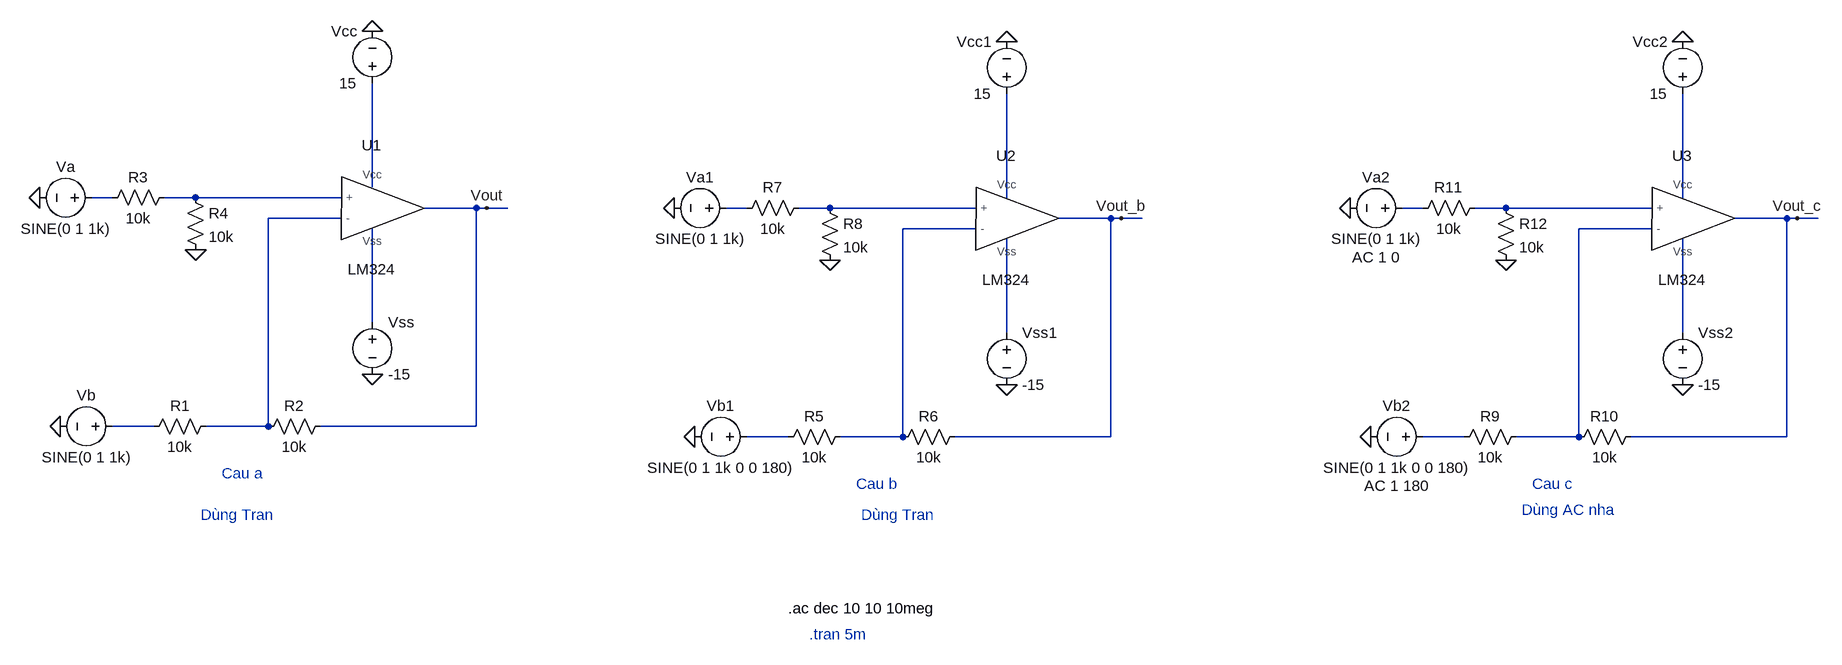
[diagram p0: schematic BAI 3 THUC HANH 3.asc]
BAI 3 THUC HANH 3.asc, the LTspice schematic file:
Version 4.1
SHEET 1 2488 800
WIRE 128 96 128 -64
WIRE -272 112 -304 112
WIRE -144 112 -192 112
WIRE 80 112 -144 112
WIRE 1104 112 1104 -48
WIRE 2144 112 2144 -48
WIRE 288 128 208 128
WIRE 304 128 288 128
WIRE 336 128 304 128
WIRE 704 128 672 128
WIRE 832 128 784 128
WIRE 1056 128 832 128
WIRE 1744 128 1712 128
WIRE 1872 128 1824 128
WIRE 2096 128 1872 128
WIRE 80 144 -32 144
WIRE 1264 144 1184 144
WIRE 1280 144 1264 144
WIRE 1312 144 1280 144
WIRE 2304 144 2224 144
WIRE 2320 144 2304 144
WIRE 2352 144 2320 144
WIRE 1056 160 944 160
WIRE 2096 160 1984 160
WIRE 128 304 128 160
WIRE 1104 320 1104 176
WIRE 2144 320 2144 176
WIRE -208 464 -272 464
WIRE -32 464 -32 144
WIRE -32 464 -128 464
WIRE 288 464 288 128
WIRE 288 464 48 464
WIRE 768 480 704 480
WIRE 944 480 944 160
WIRE 944 480 848 480
WIRE 1264 480 1264 144
WIRE 1264 480 1024 480
WIRE 1808 480 1744 480
WIRE 1984 480 1984 160
WIRE 1984 480 1888 480
WIRE 2304 480 2304 144
WIRE 2304 480 2064 480
FLAG 128 -144 0
FLAG 128 384 0
FLAG 304 128 Vout
FLAG -352 464 0
FLAG -144 192 0
FLAG -384 112 0
FLAG 1104 -128 0
FLAG 1104 400 0
FLAG 1280 144 Vout_b
FLAG 624 480 0
FLAG 832 208 0
FLAG 592 128 0
FLAG 2144 -128 0
FLAG 2144 400 0
FLAG 2320 144 Vout_c
FLAG 1664 480 0
FLAG 1872 208 0
FLAG 1632 128 0
SYMBOL LM324 128 128 R0
SYMATTR InstName U1
SYMBOL voltage 128 -48 R180
WINDOW 0 24 96 Left 2
WINDOW 3 24 16 Left 2
SYMATTR InstName Vcc
SYMATTR Value 15
SYMBOL voltage 128 288 R0
SYMATTR InstName Vss
SYMATTR Value -15
SYMBOL res -112 448 R90
WINDOW 0 0 56 VBottom 2
WINDOW 3 32 56 VTop 2
SYMATTR InstName R1
SYMATTR Value 10k
SYMBOL res 64 448 R90
WINDOW 0 0 56 VBottom 2
WINDOW 3 32 56 VTop 2
SYMATTR InstName R2
SYMATTR Value 10k
SYMBOL res -176 96 R90
WINDOW 0 0 56 VBottom 2
WINDOW 3 32 56 VTop 2
SYMATTR InstName R3
SYMATTR Value 10k
SYMBOL res -160 96 R0
SYMATTR InstName R4
SYMATTR Value 10k
SYMBOL voltage -256 464 R90
WINDOW 0 -32 56 VBottom 2
WINDOW 3 32 56 VTop 2
SYMATTR InstName Vb
SYMATTR Value SINE(0 1 1k)
SYMBOL voltage -288 112 R90
WINDOW 0 -32 56 VBottom 2
WINDOW 3 32 56 VTop 2
SYMATTR InstName Va
SYMATTR Value SINE(0 1 1k)
SYMBOL LM324 1104 144 R0
SYMATTR InstName U2
SYMBOL voltage 1104 -32 R180
WINDOW 0 24 96 Left 2
WINDOW 3 24 16 Left 2
SYMATTR InstName Vcc1
SYMATTR Value 15
SYMBOL voltage 1104 304 R0
SYMATTR InstName Vss1
SYMATTR Value -15
SYMBOL res 864 464 R90
WINDOW 0 0 56 VBottom 2
WINDOW 3 32 56 VTop 2
SYMATTR InstName R5
SYMATTR Value 10k
SYMBOL res 1040 464 R90
WINDOW 0 0 56 VBottom 2
WINDOW 3 32 56 VTop 2
SYMATTR InstName R6
SYMATTR Value 10k
SYMBOL res 800 112 R90
WINDOW 0 0 56 VBottom 2
WINDOW 3 32 56 VTop 2
SYMATTR InstName R7
SYMATTR Value 10k
SYMBOL res 816 112 R0
SYMATTR InstName R8
SYMATTR Value 10k
SYMBOL voltage 720 480 R90
WINDOW 0 -32 56 VBottom 2
WINDOW 3 32 56 VTop 2
SYMATTR InstName Vb1
SYMATTR Value SINE(0 1 1k 0 0 180)
SYMBOL voltage 688 128 R90
WINDOW 0 -32 56 VBottom 2
WINDOW 3 32 56 VTop 2
SYMATTR InstName Va1
SYMATTR Value SINE(0 1 1k)
SYMBOL LM324 2144 144 R0
SYMATTR InstName U3
SYMBOL voltage 2144 -32 R180
WINDOW 0 24 96 Left 2
WINDOW 3 24 16 Left 2
SYMATTR InstName Vcc2
SYMATTR Value 15
SYMBOL voltage 2144 304 R0
SYMATTR InstName Vss2
SYMATTR Value -15
SYMBOL res 1904 464 R90
WINDOW 0 0 56 VBottom 2
WINDOW 3 32 56 VTop 2
SYMATTR InstName R9
SYMATTR Value 10k
SYMBOL res 2080 464 R90
WINDOW 0 0 56 VBottom 2
WINDOW 3 32 56 VTop 2
SYMATTR InstName R10
SYMATTR Value 10k
SYMBOL res 1840 112 R90
WINDOW 0 0 56 VBottom 2
WINDOW 3 32 56 VTop 2
SYMATTR InstName R11
SYMATTR Value 10k
SYMBOL res 1856 112 R0
SYMATTR InstName R12
SYMATTR Value 10k
SYMBOL voltage 1760 480 R90
WINDOW 0 -32 56 VBottom 2
WINDOW 3 32 56 VTop 2
WINDOW 123 60 56 VTop 2
WINDOW 39 0 0 Left 0
SYMATTR InstName Vb2
SYMATTR Value SINE(0 1 1k 0 0 180)
SYMATTR Value2 AC 1 180
SYMBOL voltage 1728 128 R90
WINDOW 0 -32 56 VBottom 2
WINDOW 3 32 56 VTop 2
WINDOW 123 60 56 VTop 2
WINDOW 39 0 0 Left 0
SYMATTR InstName Va2
SYMATTR Value SINE(0 1 1k)
SYMATTR Value2 AC 1 0
TEXT -104 536 Left 2 ;Cau a
TEXT 800 784 Left 2 ;.tran 5m
TEXT 872 552 Left 2 ;Cau b
TEXT 1912 552 Left 2 ;Cau c
TEXT 768 744 Left 2 !.ac dec 10 10 10meg
TEXT 1896 592 Left 2 ;Dùng AC nha
TEXT 880 600 Left 2 ;Dùng Tran
TEXT -136 600 Left 2 ;Dùng Tran

The netlist it stands for:
* BAI 3 THUC HANH 3.asc
X§U1 N003 N010 N001 N013 Vout LM324  ; pins + - Vcc Vss ?
Vcc N001 0 15
Vss N013 0 -15
R1 N010 N016 10k
R2 Vout N010 10k
R3 N003 N002 10k
R4 N003 0 10k
Vb N016 0 SINE(0 1 1k)
Va N002 0 SINE(0 1 1k)
X§U2 N007 N011 N004 N014 Vout_b LM324  ; pins + - Vcc Vss ?
Vcc1 N004 0 15
Vss1 N014 0 -15
R5 N011 N017 10k
R6 Vout_b N011 10k
R7 N007 N006 10k
R8 N007 0 10k
Vb1 N017 0 SINE(0 1 1k 0 0 180)
Va1 N006 0 SINE(0 1 1k)
X§U3 N009 N012 N005 N015 Vout_c LM324  ; pins + - Vcc Vss ?
Vcc2 N005 0 15
Vss2 N015 0 -15
R9 N012 N018 10k
R10 Vout_c N012 10k
R11 N009 N008 10k
R12 N009 0 10k
Vb2 N018 0 SINE(0 1 1k 0 0 180) AC 1 180
Va2 N008 0 SINE(0 1 1k) AC 1 0
* Cau a
* .tran 5m
* Cau b
* Cau c
.ac dec 10 10 10meg
* Dùng AC nha
* Dùng Tran
* Dùng Tran
.lib E:\ThiThucHanhCoHa\CoHa\LM324.cir
.backanno
.end